# Altium schematic sheet POWERMUX.SchDoc
size Tabloid; SheetNumber: 8; SheetTotal: 9
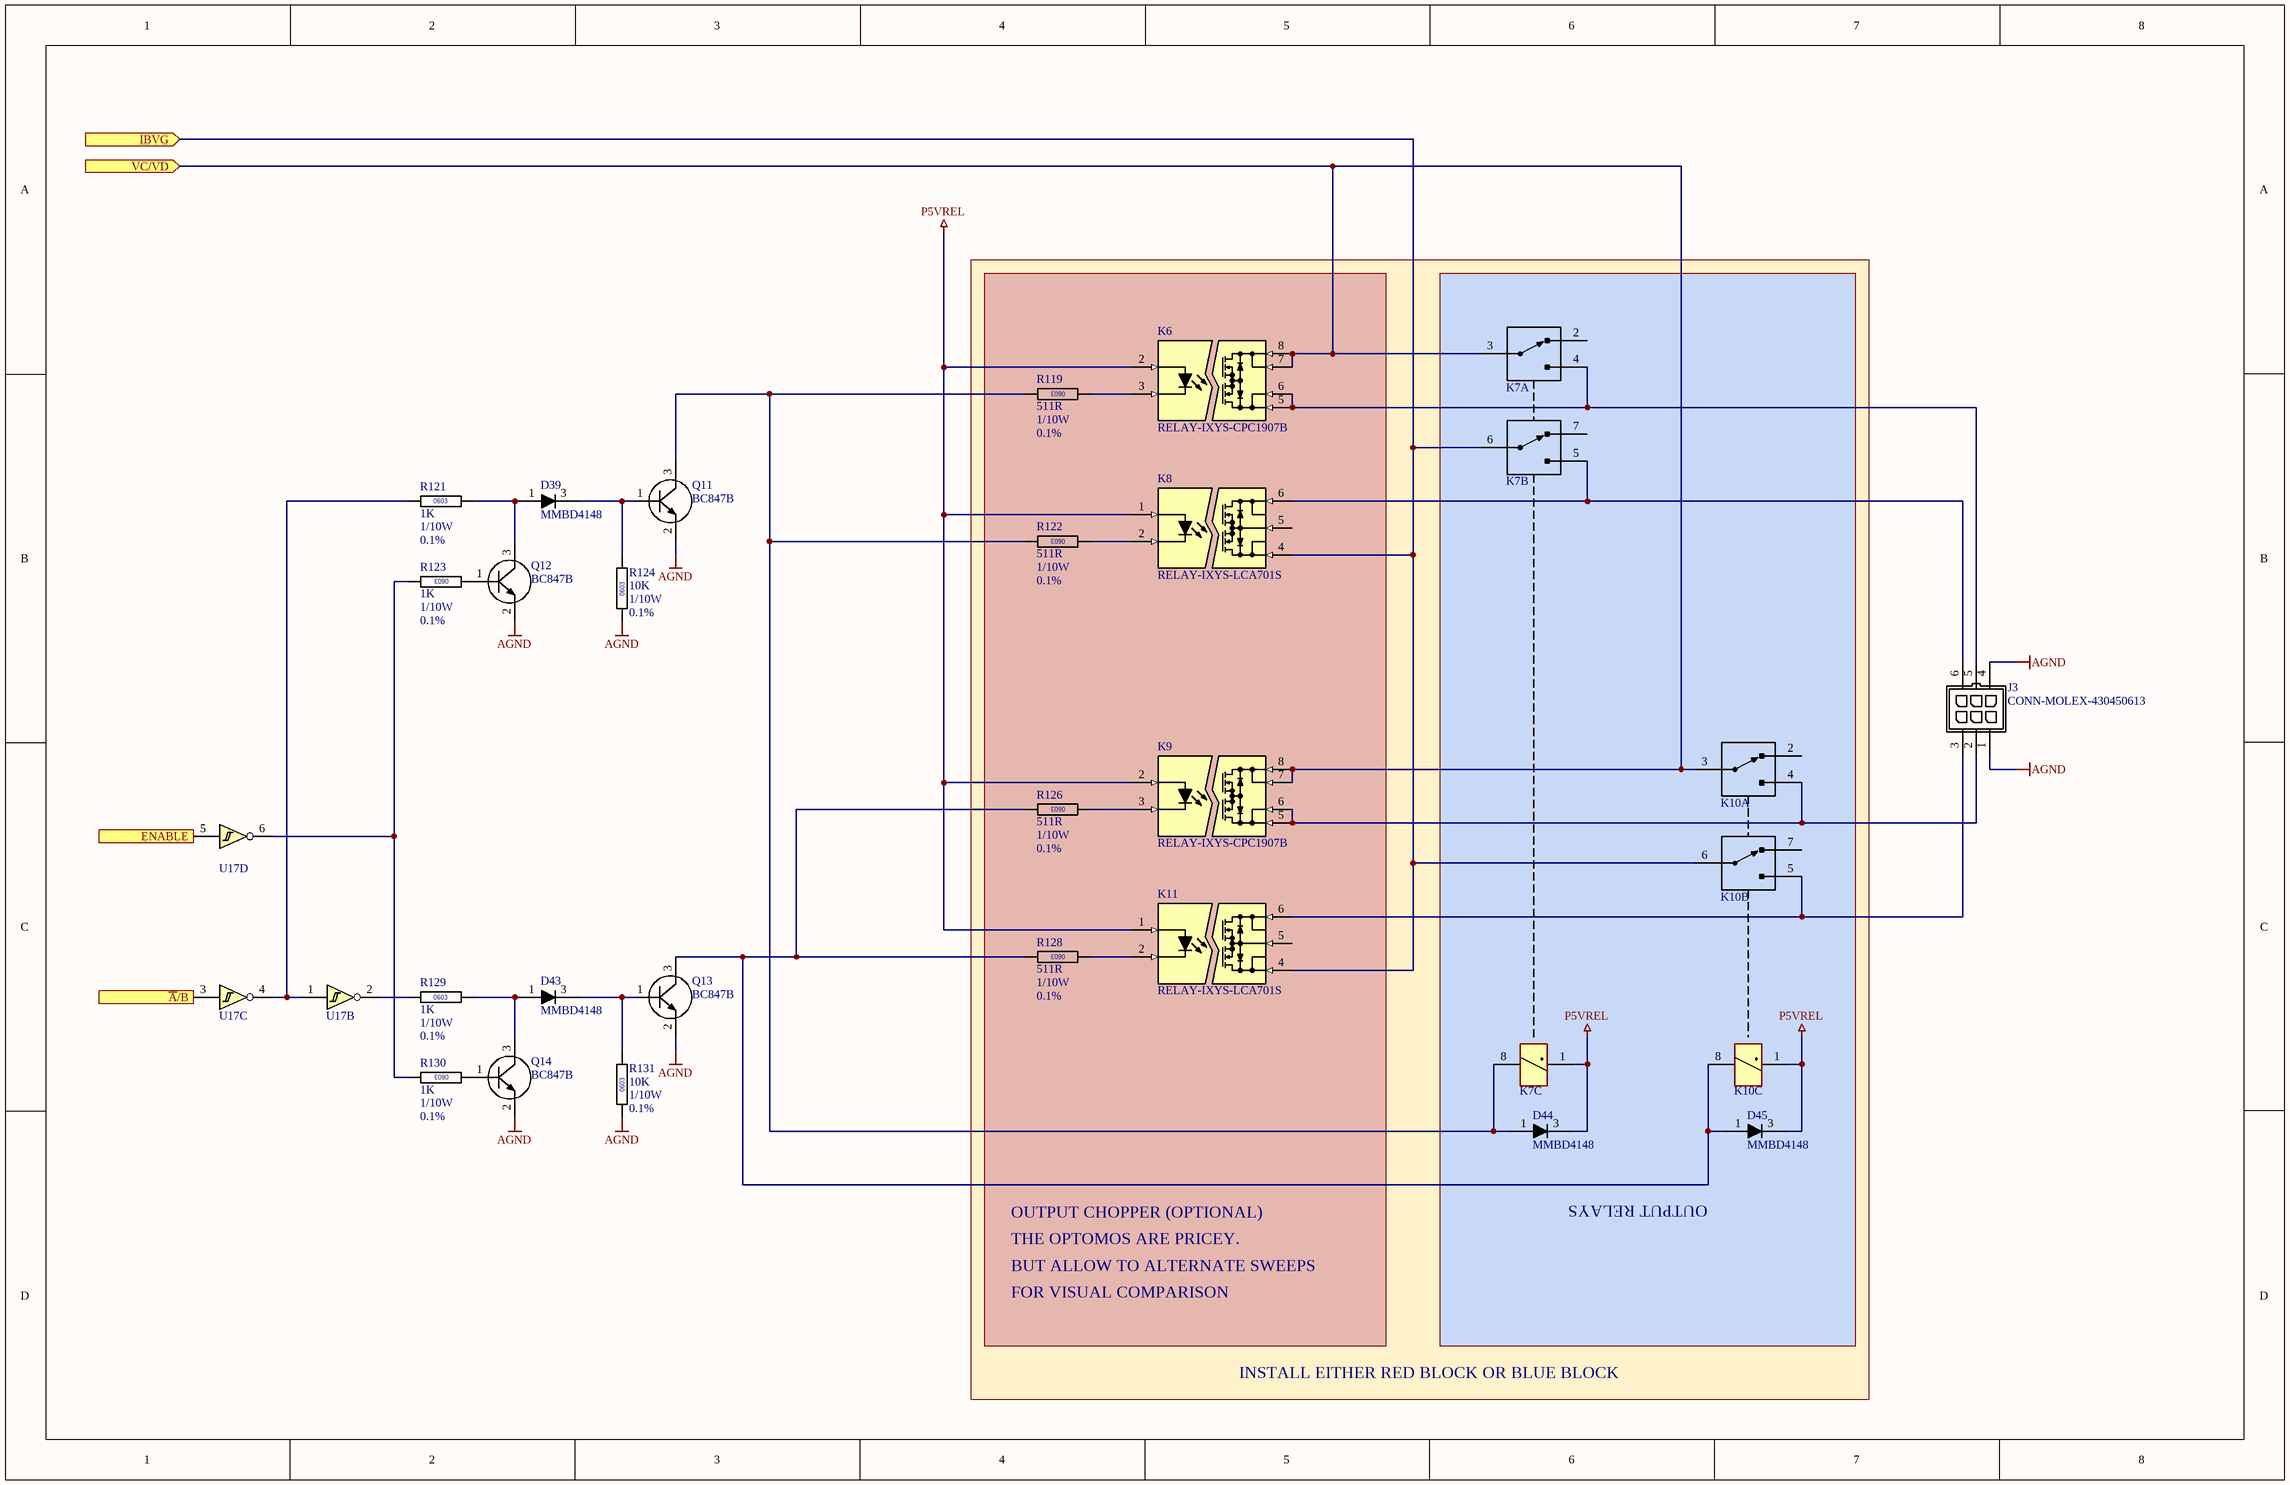
[diagram p0: POWERMUX.SchDoc]

## Parts
D39  MMBD4148
D43  MMBD4148
D44  MMBD4148
D45  MMBD4148
J3  CONN-MOLEX-430450613  [CONN-MOLEX-430450613]
K6  RELAY-IXYS-CPC1907B  [SO508P1676-8N]
K7  RELAY-KEMET-UA2-5NJ  [RELAY-KEMET-UA2-5NJ]  (value not drawn)  (parts A,B,C of 3)
K8  RELAY-IXYS-LCA701S  [SO254P960-6N]
K9  RELAY-IXYS-CPC1907B  [SO508P1676-8N]
K10  RELAY-KEMET-UA2-5NJ  [RELAY-KEMET-UA2-5NJ]  (value not drawn)  (parts A,B,C of 3)
K11  RELAY-IXYS-LCA701S  [SO254P960-6N]
Q11  BC847B  [SOT23]
Q12  BC847B  [SOT23]
Q13  BC847B  [SOT23]
Q14  BC847B  [SOT23]
R119  value 511R  Power: 1/10W  Tolerance: 0.1%  [RESC0603]  (hidden comment: RESC0603)
R121  value 1K  Power: 1/10W  Tolerance: 0.1%  [RESC0603]  (hidden comment: RESC0603)
R122  value 511R  Power: 1/10W  Tolerance: 0.1%  [RESC0603]  (hidden comment: RESC0603)
R123  value 1K  Power: 1/10W  Tolerance: 0.1%  [RESC0603]  (hidden comment: RESC0603)
R124  value 10K  Power: 1/10W  Tolerance: 0.1%  [RESC0603]  (hidden comment: RESC0603)
R126  value 511R  Power: 1/10W  Tolerance: 0.1%  [RESC0603]  (hidden comment: RESC0603)
R128  value 511R  Power: 1/10W  Tolerance: 0.1%  [RESC0603]  (hidden comment: RESC0603)
R129  value 1K  Power: 1/10W  Tolerance: 0.1%  [RESC0603]  (hidden comment: RESC0603)
R130  value 1K  Power: 1/10W  Tolerance: 0.1%  [RESC0603]  (hidden comment: RESC0603)
R131  value 10K  Power: 1/10W  Tolerance: 0.1%  [RESC0603]  (hidden comment: RESC0603)
U17  IC-TI-74HC14  [SOT23-6]  (value not drawn)  (parts B,C,D of 7)

## Blocks framed on the sheet
OUTPUT RELAYS: D44 D45 K7 K10

## Ports
ENABLE (in), IBVG (in), VC/VD (in), ~{A}/B (in)

## Nets
AGND: J3.1 J3.4 Q11.2(E) Q12.2(E) Q13.2(E) Q14.2(E) R124.2 R131.2
P5VREL: D44.3(K) D45.3(K) K6.2 K7.1 K8.1 K9.2 K10.1 K11.1
~{A}/B: U17.3 ; port ~{A}/B
ENABLE: U17.5 ; port ENABLE
IBVG: K7.6(COM) K8.4 K10.6(COM) K11.4 ; port IBVG
VC/VD: K6.7 K6.8 K7.3(COM) K9.7 K9.8 K10.3(COM) ; port VC/VD
NetD39_1: D39.1(A) Q12.3(C) R121.1
NetD39_3: D39.3(K) Q11.1(B) R124.1
NetD43_1: D43.1(A) Q14.3(C) R129.1
NetD43_3: D43.3(K) Q13.1(B) R131.1
NetD44_1: D44.1(A) K7.8 Q11.3(C) R119.1 R122.1
NetD45_1: D45.1(A) K10.8 Q13.3(C) R126.1 R128.1
NetJ3_2: J3.2 K9.5 K9.6 K10.4(NO)
NetJ3_3: J3.3 K10.5(NO) K11.6
NetJ3_5: J3.5 K6.5 K6.6 K7.4(NO)
NetJ3_6: J3.6 K7.5(NO) K8.6
NetK6_3: K6.3 R119.2
NetK8_2: K8.2 R122.2
NetK9_3: K9.3 R126.2
NetK11_2: K11.2 R128.2
NetQ12_1: Q12.1(B) R123.2
NetQ14_1: Q14.1(B) R130.2
NetR121_2: R121.2 U17.1 U17.4
NetR123_1: R123.1 R130.1 U17.6
NetR129_2: R129.2 U17.2

Not connected (* = marked no-connect by the designer): K7 2(NC) 7(NC); K8 5; K10 2(NC) 7(NC); K11 5

## Notes on the sheet
- OUTPUT CHOPPER (OPTIONAL)
- THE OPTOMOS ARE PRICEY.
- BUT ALLOW TO ALTERNATE SWEEPS
- FOR VISUAL COMPARISON
- INSTALL EITHER RED BLOCK OR BLUE BLOCK
- (in symbol RESC-0603-1K-0.1%-1/10W) 0603
- (in symbol RESC-0603-10K-0.1%-1/10W) 0603
- (in symbol RESC-0603-511R-0.1%-1/10W) 0603

## Library data of the parts
D39 D43-D45 = DIODE-RECTIFIER-DIODES-MMBD4148-SOT23: DIODE,RECTIFIER,75V,0.3A,MMBD4148,SOT23; Manufacturer 1: DIODES; Manufacturer Part Number 1: MMBD4148
J3 = CONN-MOLEX-430450613: CONN,2X3,MOLEX MICROFIT,TH,VERT
K6 K9 = RELAY-IXYS-CPC1907B: RELAY,OPTOMOS,6A,60V,AC,IXYS,CPC1907B,SMD
K7 K10 = RELAY-KEMET-UA2-5NJ: RELAY,DPDT,1A,250VAC,220VDC,5V COIL,KEMET,UA2-5NJ; DIGIKEY: 399-UA2-5NJ-ND; Manufacturer 1: KEMET; Manufacturer Part Number 1: UA2-5NJ
K8 K11 = RELAY-IXYS-LCA701S: RELAY,OPTOMOS,1.5A,100V,AC,IXYS,LCA701S,SMD
Q11-Q14 = XSTR-NPN-BC847: XSTR,NPN,45V,0.1A,,BC847B,SOT23
R119 R122 R126 R128 = RESC-0603-511R-0.1%-1/10W: RESISTOR,511R,0.1%,100mW,0603 (1608); Location: *
R121 R123 R129 R130 = RESC-0603-1K-0.1%-1/10W: RESISTOR,1K,0.1%,100mW,0603 (1608); Location: *
R124 R131 = RESC-0603-10K-0.1%-1/10W: RESISTOR,10K,0.1%,100mW,0603 (1608); Location: *
U17 = IC-TI-74HC14-SO14: IC,NOT,HEX,SCHMITTTRIGGER,ONSEMI,MC74AC14DR2G,SO14; DIGIKEY: MC74AC14DR2GOSCT-ND; Manufacturer 1: ONSEMI; Manufacturer Part Number 1: MC74AC14DR2G